# EAGLE design FTDI Basic 5V-v12 (EAGLE 6.2)
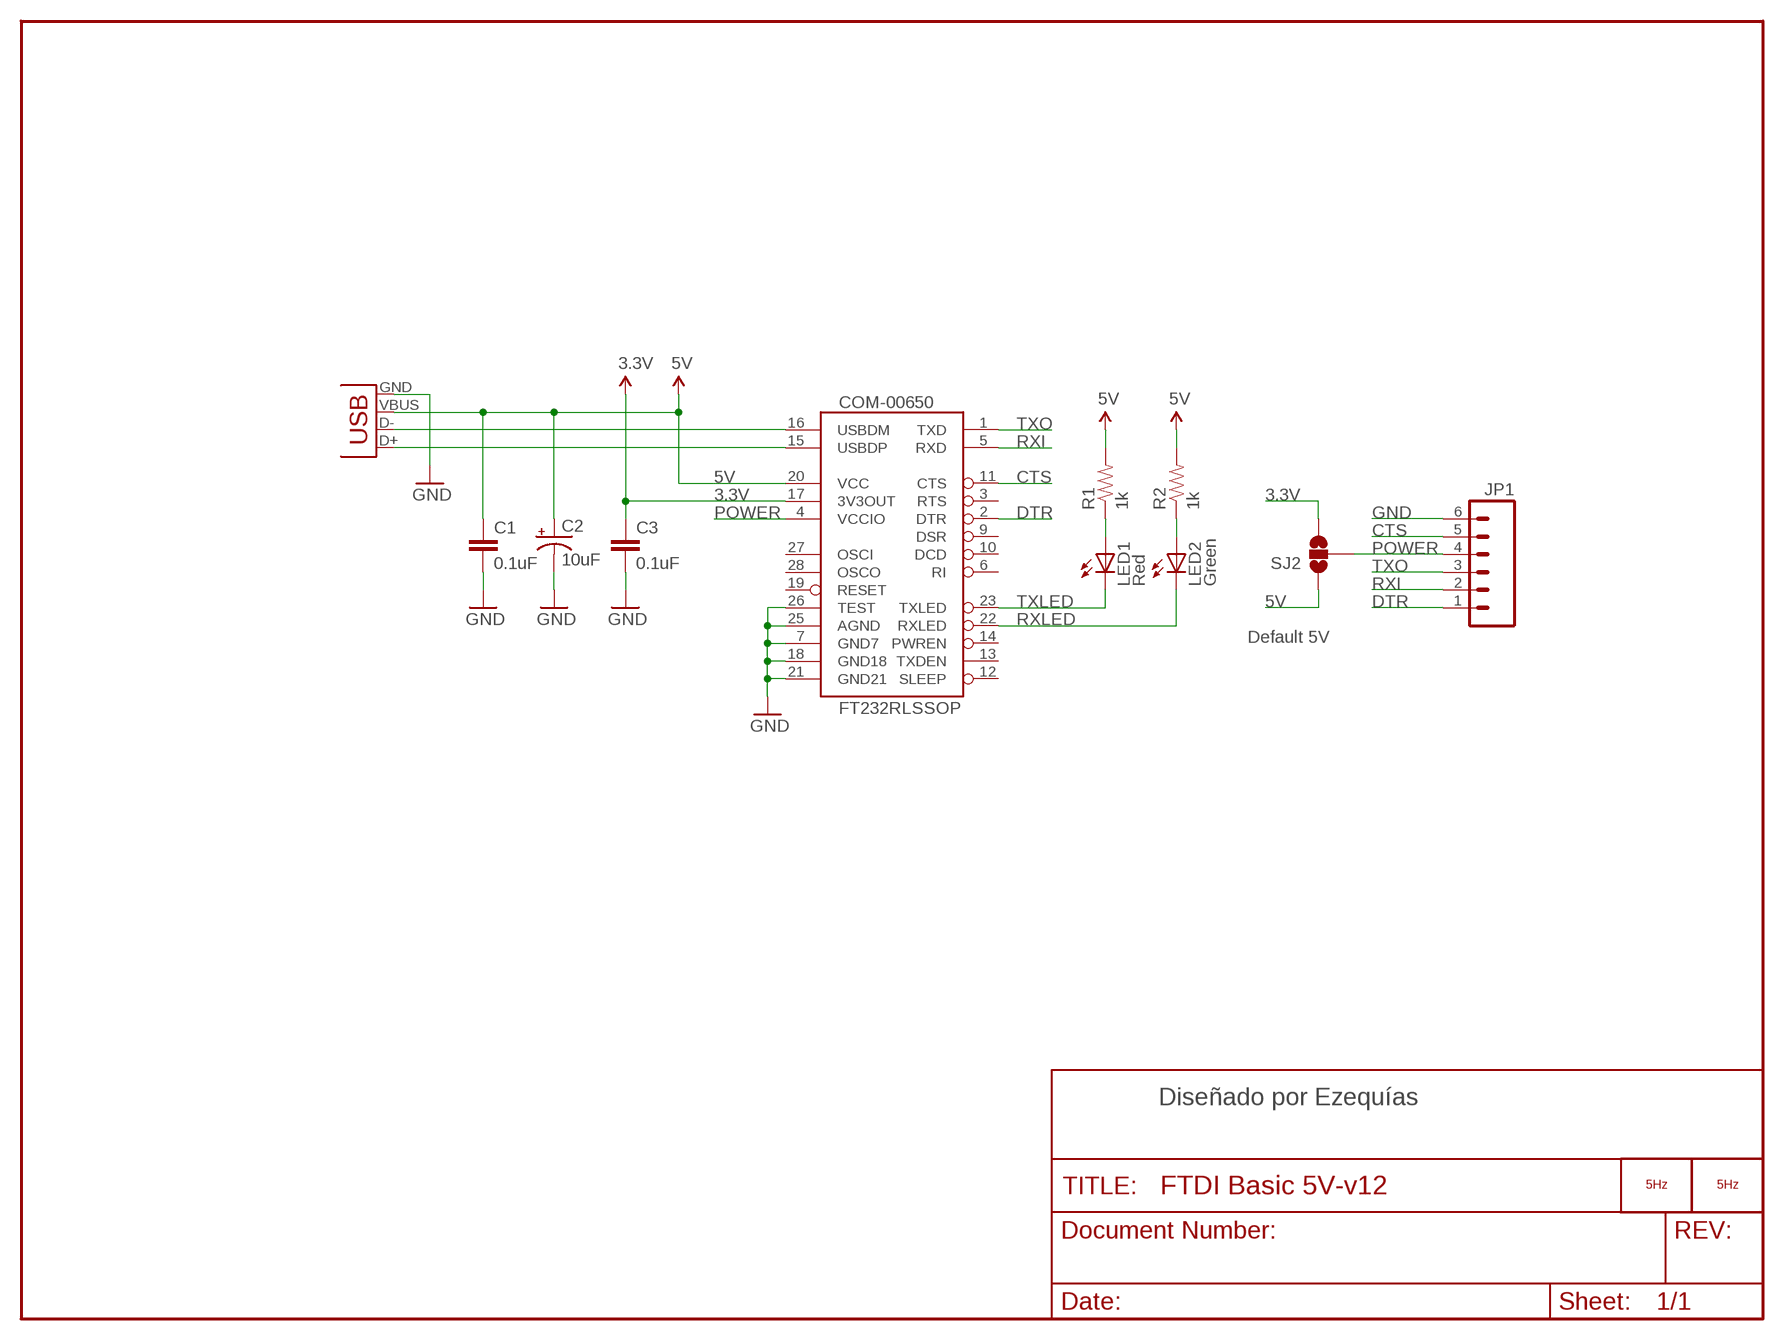
[diagram p0: schematic, sheet 1]

## Parts
C1  0.1uF  CAP0603-CAP  [0603-CAP]
C2  10uF  CAP_POL1206  [EIA3216]
C3  0.1uF  CAP0603-CAP  [0603-CAP]
COM-00650  FT232RLSSOP  [SSOP28DB]
JP1  M06SIP  [1X06]
LED1  Red  LED0603  [LED-0603]
LED2  Green  LED0603  [LED-0603]
LOGO1  LOGO_5HZ_H_5MM  [5HZ_LOGO_H_5MM]
LOGO2  LOGO_5HZ_H_15MM  [5HZ_LOGO_H_15MM]
PRT-00587  897-43-005-00-100001  USBSMD  [USB-MINIB]
R1  1k  RESISTOR0603-RES  [0603-RES]
R2  1k  RESISTOR0603-RES  [0603-RES]
SJ2  SOLDERJUMPER_2WAYS  [SJ_3]

## Nets
3.3V [power]: C3.1 COM-00650.17(3V3OUT) SJ2.3
5V: C1.1 C2.A(+) COM-00650.20(VCC) PRT-00587.VBUS R1.2 R2.2 SJ2.1
CTS: COM-00650.11(CTS) JP1.5
DTR: COM-00650.2(DTR) JP1.1
GND [power]: C1.2 C2.C(-) C3.2 COM-00650.7(GND7) COM-00650.18(GND18) COM-00650.21(GND21) COM-00650.25(AGND) COM-00650.26(TEST) JP1.6 PRT-00587.GND
N$1: LED1.A R1.1
N$2: LED2.A R2.1
POWER: COM-00650.4(VCCIO) JP1.4 SJ2.2
RXI: COM-00650.5(RXD) JP1.2
RXLED: COM-00650.22(RXLED) LED2.C
TXLED: COM-00650.23(TXLED) LED1.C
TXO: COM-00650.1(TXD) JP1.3
USB_D+: COM-00650.15(USBDP) PRT-00587.D+
USB_D-: COM-00650.16(USBDM) PRT-00587.D-
Unconnected: COM-00650.3(RTS) COM-00650.6(RI) COM-00650.9(DSR) COM-00650.10(DCD) COM-00650.12(SLEEP) COM-00650.13(TXDEN) COM-00650.14(PWREN) COM-00650.19(RESET) COM-00650.27(OSCI) COM-00650.28(OSCO)

## Notes on the sheet
- Default 5V
- Diseñado por Ezequías

## Library data of the parts
C1 C3 = SparkFun:CAP: Capacitor Standard 0603 ceramic capacitor, and 0.1" leaded capacitor.
C2 = SparkFun:CAP_POL: Capacitor Polarized These are standard SMD and PTH capacitors. Normally 10uF, 47uF, and 100uF in electrolytic and tantalum varieties. Always verify the external diameter of the through hole cap, it varies with capacity, voltage, and manufacturer. The EIA devices should be standard.
COM-00650 = SparkFun:FT232RL: USB UART FT232RL 4th Generation USB UART (USB <-> Serial) Controller. Spark Fun Electronics SKU : COM-00650
JP1 = SparkFun:M06: Header 6 Standard 6-pin 0.1" header. Use with straight break away headers (SKU : PRT-00116), right angle break away headers (PRT-00553), swiss pins (PRT-00743), machine pins (PRT-00117), and female headers (PRT-00115). Molex polarized connector foot print use with SKU : PRT-08094 with associated crimp pins and housings. NOTES ON THE VARIANTS LOCK and LOCK_LONGPADS... This footprint was designed to help hold the alignment of a through-hole component (i.e. 6-pin header) while soldering it into place. You may notice that each hole has been shifted either up or down by 0.005 of an inch from it's more standard position (which is a perfectly straight line). This slight alteration caused the pins (the squares in the middle) to touch the edges of the holes. Because they are alternating, it causes a "brace" to hold the component in place. 0.005 has proven to be the perfect amount of "off-center" position when using our standard breakaway headers. Although looks a little odd when you look at the bare footprint, once you have a header in there, the alteration is very hard to notice. Also, if you push a header all the way into place, it is covered up entirely on the bottom side. This idea of altering the position of holes to aid alignment will be further integrated into the Sparkfun Library for other footprints. It can help hold any component with 3 or more connection pins.
LED1 LED2 = SparkFun:LED: LEDs Standard schematic elements and footprints for 5mm, 3mm, 1206, and 0603 sized LEDs. 5mm - Spark Fun Electronics SKU : COM-00529 (and others)
LOGO1 LOGO2 = 5hz-electronica:LOGO_5HZ: Logotipo 5Hz "según Pedro"
PRT-00587 = SparkFun:USB: USB Connectors USB-B-PTH is fully proven SKU : PRT-00139 USB-miniB is fully proven SKU : PRT-00587 USB-A-PCB is untested. USB-A-H is throughly reviewed, but untested. Spark Fun Electronics SKU : PRT-00437 USB-B-SMT is throughly reviewed, but untested. Needs silkscreen touching up. USB-A-S has not been used/tested USB-MB-H has not been used/tested
R1 R2 = SparkFun:RESISTOR: Resistor Basic schematic elements and footprints for 0603, 1206, and PTH resistors.
SJ2 = SparkFun:SOLDERJUMPER_2WAY: Solder Jumper 2 way solder jumper

## Net classes
0 default: width 0.203 mm
1 power: width 0.254 mm

## Board
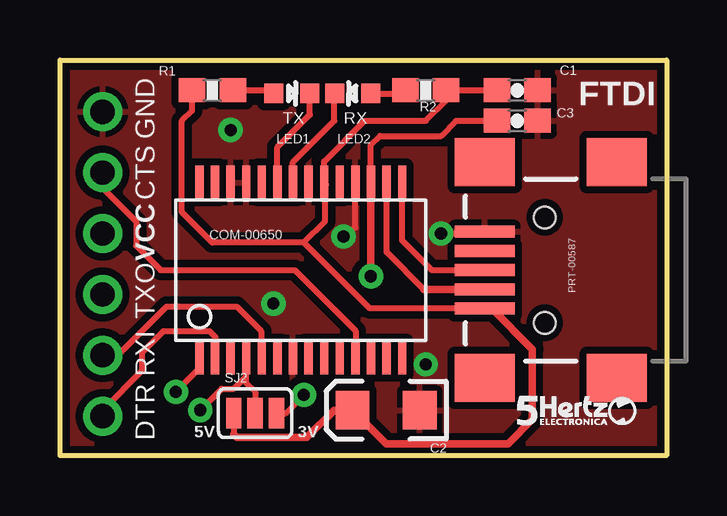
[diagram p1: board, top side]
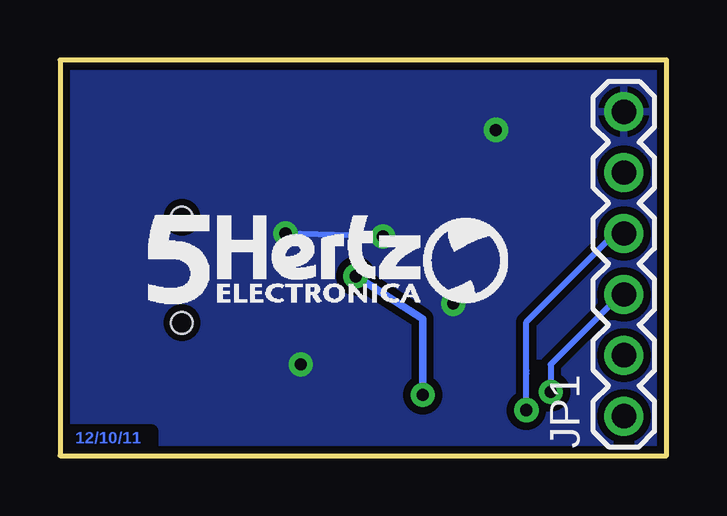
[diagram p2: board, bottom side, seen from below]

Size 25.27 x 16.51 mm. Coordinates in mm from the lower left corner, seen from the top.
Outline: 0,16.51 25.27,16.51 25.27,0 0,0 0,16.51
Copper layers (1*16): Top 0.035mm / dielectric 1.5mm / Bottom 0.035mm
Design rules: minimum track width 8mil, minimum drill 20mil, track to track 8mil, track to pad 8mil, pad to pad 8mil, via to via 8mil, smd to smd 8mil, copper to edge 10mil, drill to drill 8mil, minimum pad ring 12mil, minimum via ring 10mil, stop-mask expansion 4mil, vias tented up to drill 25mil, thermal gap 10mil

### Footprints (pad centres in the part's own frame; a part is rotated, then mirrored left to right if it is on the bottom)
0603-CAP = smd 1.1 x 1: 1 -0.85,0; 2 0.85,0
EIA3216 = smd 1.4 x 1.6: A 1.4,0; C -1.4,0
SSOP28DB = smd 0.348 x 1.397: 1 -4.225,-3.656; 2 -3.575,-3.656; 3 -2.925,-3.656; 4 -2.275,-3.656; 5 -1.625,-3.656; 6 -0.975,-3.656; 7 -0.325,-3.656; 8 0.325,-3.656; 9 0.975,-3.656; 10 1.625,-3.656; 11 2.275,-3.656; 12 2.925,-3.656; 13 3.575,-3.656; 14 4.225,-3.656; 15 4.225,3.656; 16 3.575,3.656; 17 2.925,3.656; 18 2.275,3.656; 19 1.625,3.656; 20 0.975,3.656; 21 0.325,3.656; 22 -0.325,3.656; 23 -0.975,3.656; 24 -1.625,3.656; 25 -2.275,3.656; 26 -2.925,3.656; 27 -3.575,3.656; 28 -4.225,3.656
1X06 = drill 1.016: 1 0,0; 2 2.54,0; 3 5.08,0; 4 7.62,0; 5 10.16,0; 6 12.7,0
LED-0603 = smd 0.8 x 0.8: A 0,-0.75; C 0,0.75
USB-MINIB = smd 2.5 x 0.5: D+ 2.5,0; D- 2.5,0.8; GND 2.5,-1.6; ID 2.5,-0.8; VBUS 2.5,1.6 | smd 2.5 x 2: GND@1 -3,-4.5; GND@2 -3,4.5; GND@3 2.5,4.5; GND@4 2.5,-4.5 | hole 0.9: 0,2.2; 0,-2.2
0603-RES = smd 1.1 x 1: 1 -0.85,0; 2 0.85,0
SJ_3 = smd 0.635 x 1.27: 1 -0.889,0; 2 0,0; 3 0.889,0

### Placement (x,y rotation side)
C1  19.05,15.24 0 top
C2  13.59,1.91 180 top
C3  19.05,13.97 0 top
COM-00650  10.03,7.75 0 top
JP1  1.78,1.65 90 bottom
LED1  9.65,15.11 270 top
LED2  12.19,15.11 90 top
LOGO1  19.05,1.27 0 top
LOGO2  21.59,6.35 0 bottom
PRT-00587  20.19,7.75 180 top
R1  6.35,15.24 180 top
R2  15.24,15.24 0 top
SJ2  8.13,1.78 0 top

### Tracks (layer width: path | path; a pad name or v marks a point on that pad's centre or on a via)
3.3V  (via drill 0.51)
  Top 0.254: SJ2.3 9.4,1.78 v10.16,2.54 | 12.95,11.43 12.96,11.43 COM-00650.17 12.96,12.96 13.34,13.34 15.88,13.34 16.51,13.97 C3.1
  Top 0.305: v12.95,7.49 12.95,11.43
  Bottom 0.305: v10.16,2.54 10.16,5.71 v12.95,7.49
5V
  Top 0.254: 18.29,6.1 17.78,6.1 17.73,6.15 PRT-00587.VBUS 12.9,6.15 10.16,8.89 | 11.43,1.91 C2.A | SJ2.1 7.24,0.89 | C1.1 R2.2 16.09,14.82 15.24,13.97 12.7,13.97 11.01,12.28 COM-00650.20 | R1.2 5.5,14.39 5.08,13.97 5.08,10.16 6.35,8.89 10.16,8.89 | 11.05,11.3 11.05,9.78 10.16,8.89
  Top 0.305: 11.43,1.91 10.29,0.76 7.37,0.76 7.24,0.89 | PRT-00587.VBUS 17.98,6.15 19.68,4.45 19.68,1.52 18.67,0.51 13.59,0.51 C2.A | 11.05,11.3 11.01,11.34 COM-00650.20
CTS
  Top 0.254: COM-00650.11 12.31,4.08 12.32,4.06 12.32,5.21 9.78,7.75 4.19,7.75 3.17,8.76 3.17,9.78 1.78,11.18 JP1.5
DTR
  Top 0.254: COM-00650.2 6.48,4.06 6.48,4.95 6.22,5.21 4.32,5.21 3.43,4.32 3.43,3.56 1.78,1.91 JP1.1
GND  (via drill 0.51)
  Top 0.254: COM-00650.18 12.31,9.51 v11.81,9.14 | v15.88,9.27 17.62,9.27 PRT-00587.GND
  Bottom 0.254: v11.81,9.14 v15.88,9.27
  other vias: 7.11,13.59 15.24,3.81 8.89,6.35
  pour Top (isolate 0.305): 0,16.51 25.27,16.51 25.27,0 0.13,0
  pour Bottom (isolate 0.305): 0,16.51 25.27,16.51 25.27,0 24.51,0 1.91,0.13 -0.13,0.13
N$1
  Top 0.254: R1.1 8.78,15.24 LED1.A
N$2
  Top 0.254: LED2.A 14.26,15.11 R2.1
POWER  (via drill 0.51)
  Top 0.254: SJ2.2 8.13,2.67 7.75,3.05 7.75,4.06 7.76,4.08 COM-00650.4 7.76,3.31 7.24,2.79 6.73,2.79 v5.84,1.91
  Bottom 0.254: v5.84,1.91 5.84,3.43 5.84,3.56 5.84,5.59 2.16,9.27
  Bottom 0.305: 2.16,9.27 JP1.4
RXI
  Top 0.254: JP1.2 2.41,4.19 4.45,6.22 7.37,6.22 8.38,5.21 8.38,4.12 COM-00650.5 8.38,4.06
RXLED
  Top 0.254: COM-00650.22 9.71,12.25 11.43,13.97 LED2.C
TXLED
  Top 0.254: COM-00650.23 9.06,12.87 10.41,14.22 10.41,15.1 LED1.C
TXO  (via drill 0.51)
  Top 0.254: COM-00650.1 5.81,3.65 v4.83,2.67
  Bottom 0.254: v4.83,2.67 4.83,3.81 1.91,6.73
  Bottom 0.305: JP1.3 1.91,6.73
USB_D+
  Top 0.254: PRT-00587.D+ 15.49,7.75 14.26,8.98 COM-00650.15
USB_D-
  Top 0.254: COM-00650.16 13.61,8.49 15.15,6.95
  Top 0.305: 15.15,6.95 PRT-00587.D-

### Text on the board
Bottom: 12/10/11
tPlace: FTDI | TX | RX | GND | CTS | VCC | TXO | RXI | DTR | 5V | 3V
tValues: Close